# EAGLE schematic powe-board (EAGLE 7.6.0)
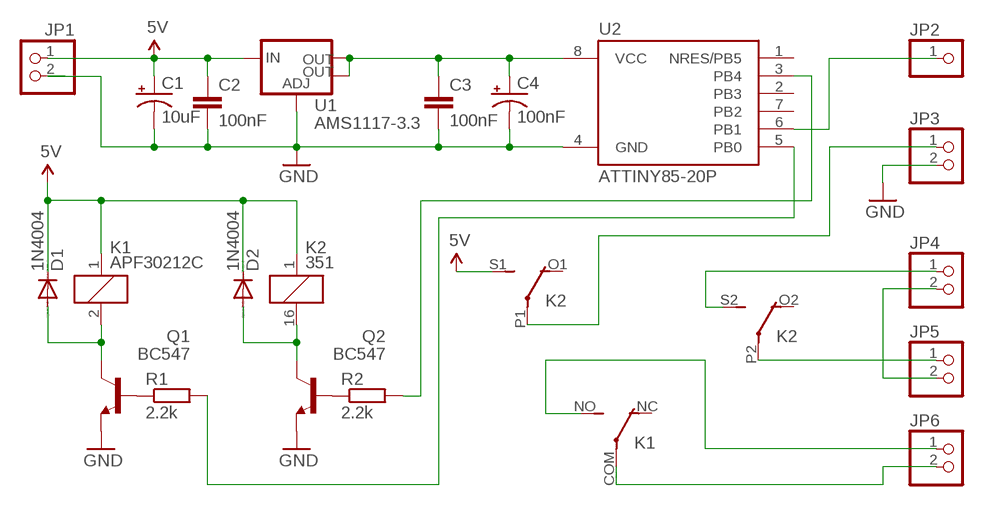
[diagram p0: schematic, sheet 1]

## Parts
C1  10uF  10UF-25V-20%(PTH)KIT  [CPOL-RADIAL-10UF-25V-KIT]
C2  100nF  CAP0402-CAP  [0402-CAP]
C3  100nF  CAP0402-CAP  [0402-CAP]
C4  100nF  10UF-25V-20%(PTH)KIT  [CPOL-RADIAL-10UF-25V-KIT]
D1  1N4004  [DO41-10]
D2  1N4004  [DO41-10]
JP1  PINHD-1X2  [1X02]
JP2  PINHD-1X1  [1X01]
JP3  PINHD-1X2  [1X02]
JP4  PINHD-1X2  [1X02]
JP5  PINHD-1X2  [1X02]
JP6  PINHD-1X2  [1X02]
K1  APF30212C  [APF30212C]
K2  351  [351]
Q1  BC547  [TO92]
Q2  BC547  [TO92]
R1  2.2k  R-EU_0204/7  [0204/7]
R2  2.2k  R-EU_0204/7  [0204/7]
U1  AMS1117-3.3  V_REG_LM1117SOT223  [SOT223]
U2  ATTINY85-20P  [PDIP08_300MIL]

## Nets
5V: C1.1(+) C2.1 D1.C D2.C JP1.1 K1.1 K2.1 K2.S1(2:S) U1.3(IN)
GND: C1.2(-) C2.2 C3.2 C4.2(-) JP1.2 JP3.2 Q1.1(E) Q2.1(E) U1.1(ADJ) U2.4(GND)
N$1: Q1.2(B) R1.1
N$2: R1.2 U2.5(PB0)
N$3: R2.2 U2.3(PB4)
N$4: C3.1 C4.1(+) U1.2(OUT) U1.4(OUT) U2.8(VCC)
N$5: D1.A K1.2 Q1.3(C)
N$6: JP2.1 U2.6(PB1)
N$7: JP3.1 K2.P1(2:P)
N$8: Q2.2(B) R2.1
N$9: D2.A K2.16 Q2.3(C)
N$10: JP4.2 JP5.2
N$11: JP4.1 K2.S2(3:S)
N$12: JP5.1 K2.P2(3:P)
N$13: JP6.1 K1.NO(2:S)
N$14: JP6.2 K1.COM(2:P)
Unconnected: K1.NC(2:O) K2.O1(2:O) K2.O2(3:O) U2.1(NRES/PB5) U2.2(PB3) U2.7(PB2)

## Library data of the parts
C1 C4 = SparkFun-Capacitors:10UF-25V-20%(PTH): CAP-08440; PROD_ID: CAP-08440
C2 C3 = SparkFun-Capacitors:CAP: Capacitor Standard 0603 ceramic capacitor, and 0.1" leaded capacitor.
D1 D2 = diode:1N4004: DIODE general purpose rectifier, 1 A
JP1 JP3-JP6 = pinhead:PINHD-1X2: PIN HEADER
JP2 = pinhead:PINHD-1X1: PIN HEADER
K1 = relay:APF30212C: Compliant with European standards 1a/1c 6A Slim power relays Source: Data sheet <http://pewa.panasonic.com/assets/pcsd/catalog/pf-catalog.pdf>; OC_FARNELL: unknown
K2 = relay:351: RELAY 2 x switch, Omron; OC_FARNELL: unknown; OC_NEWARK: unknown
Q1 Q2 = transistor-npn:BC547*: NPN Transistor
R1 R2 = resistor:R-EU_: RESISTOR, European symbol
U1 = SparkFun-PowerIC:V_REG_LM1117: Voltage Regulator LM1117 Standard adjustable voltage regulator but in SMD form. Spark Fun Electronics SKU : COM-00595; PROD_ID: VREG-08170
U2 = atmega-atxmega:ATTINY85*: ATMEL ATtiny 85 Packages: P = PDIP 08 30mil S = SOIC 08 EIAJ 208mil Technologies Note: for complete ordering code (temp. range, finish, tape&reel etc.) see www.atmel.com • Supply Voltage: V = (1.8…5.5)V | [blank] = (2.7…5.5)V • Speed: 10 = 10 MHz | 20 = 20 MHz Author: Dipl.-Ing. FH Rainer Bayer HHN Hochschule Heilbronn (Heilbronn University), rainer.bayer@hs-heilbronn.de Ingenieurbüro ing-rb, mail@ing-rb.de